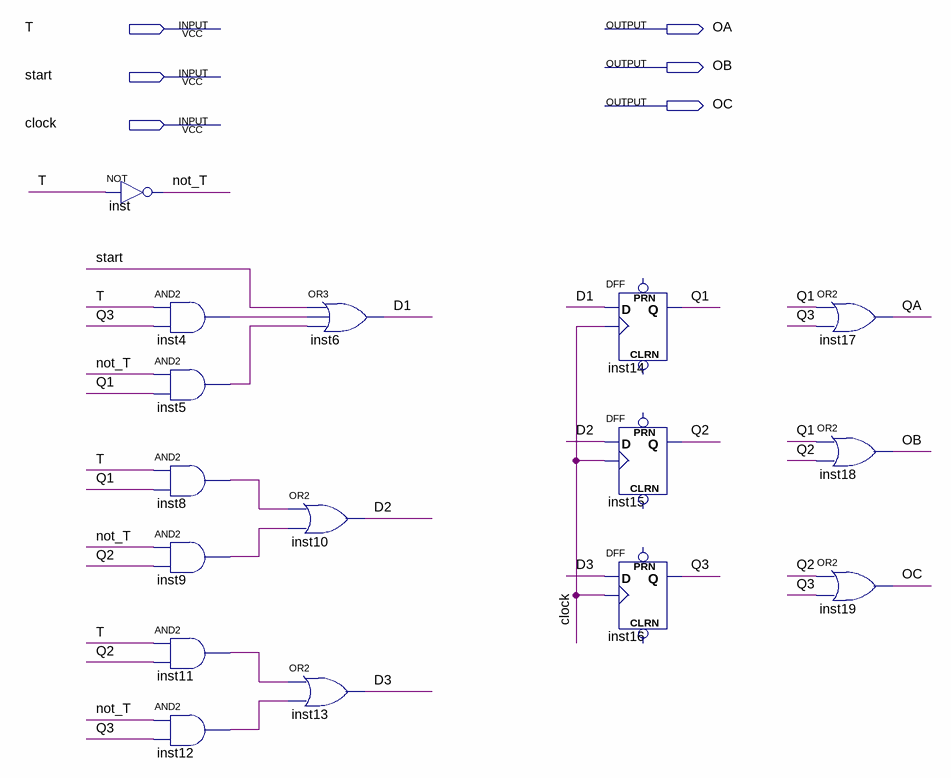
[diagram p0: schematic sheet]
// Quartus schematic MultiCycleCPU.bdf as structural Verilog: 16 symbols, 6 pins
module MultiCycleCPU (
  input  T,
  input  start,
  input  clock,
  output OA,
  output OB,
  output OC
);

  wire D1, D2, D3, inst4_out, inst5_out, inst8_out, inst9_out, inst11_out, inst12_out, not_T, Q1, Q2, Q3, QA;

  not inst (not_T, T);
  and inst4 (inst4_out, T, Q3);
  and inst5 (inst5_out, not_T, Q1);
  and inst8 (inst8_out, T, Q1);
  and inst9 (inst9_out, not_T, Q2);
  and inst11 (inst11_out, T, Q2);
  and inst12 (inst12_out, not_T, Q3);
  or inst6 (D1, start, inst4_out, inst5_out);
  or inst10 (D2, inst8_out, inst9_out);
  or inst13 (D3, inst11_out, inst12_out);
  DFF inst14 (.CLK(clock), .D(D1), .Q(Q1));  // open: CLRN, PRN
  DFF inst15 (.CLK(clock), .D(D2), .Q(Q2));  // open: CLRN, PRN
  DFF inst16 (.CLK(clock), .D(D3), .Q(Q3));  // open: CLRN, PRN
  or inst17 (QA, Q1, Q3);
  or inst18 (OB, Q1, Q2);
  or inst19 (OC, Q2, Q3);
endmodule
